# Altium schematic sheet MT-MONITOR V1.0.0.SchDoc
size A1; SheetNumber: 0; SheetTotal: 0
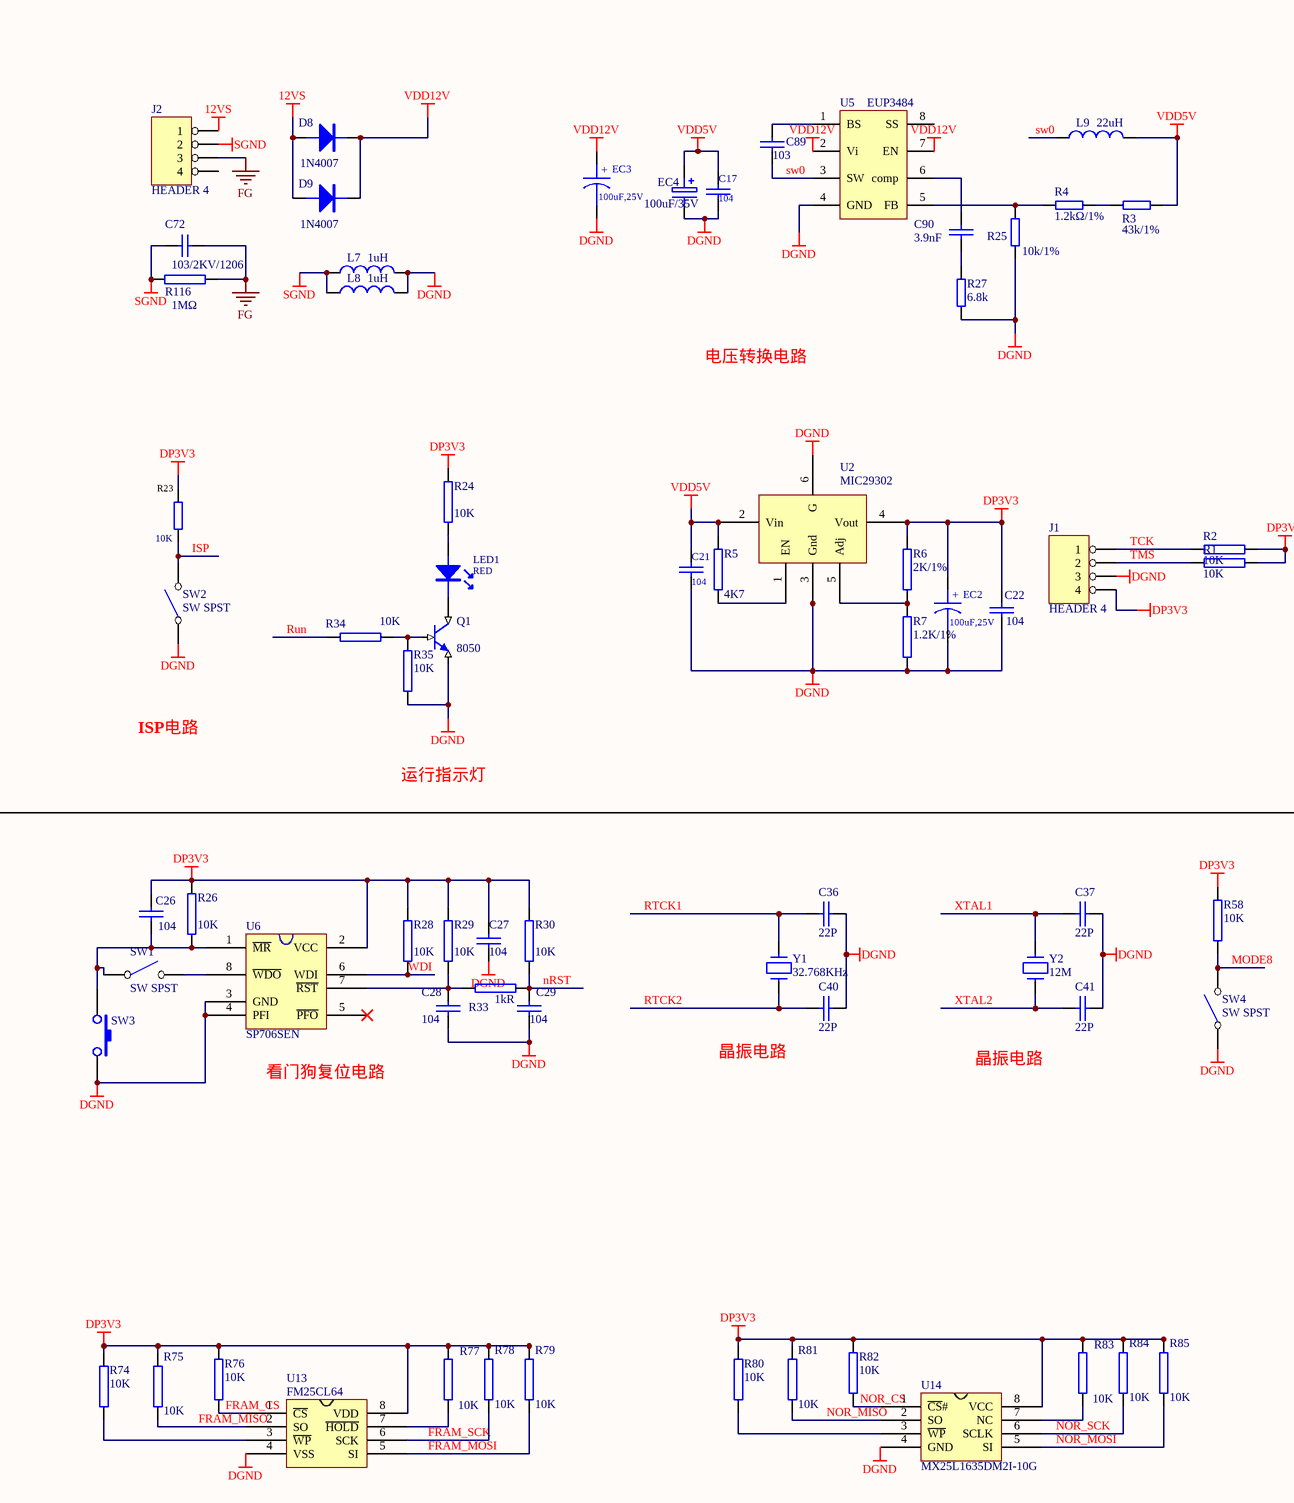
[diagram p0: MT-MONITOR V1.0.0.SchDoc, top left]
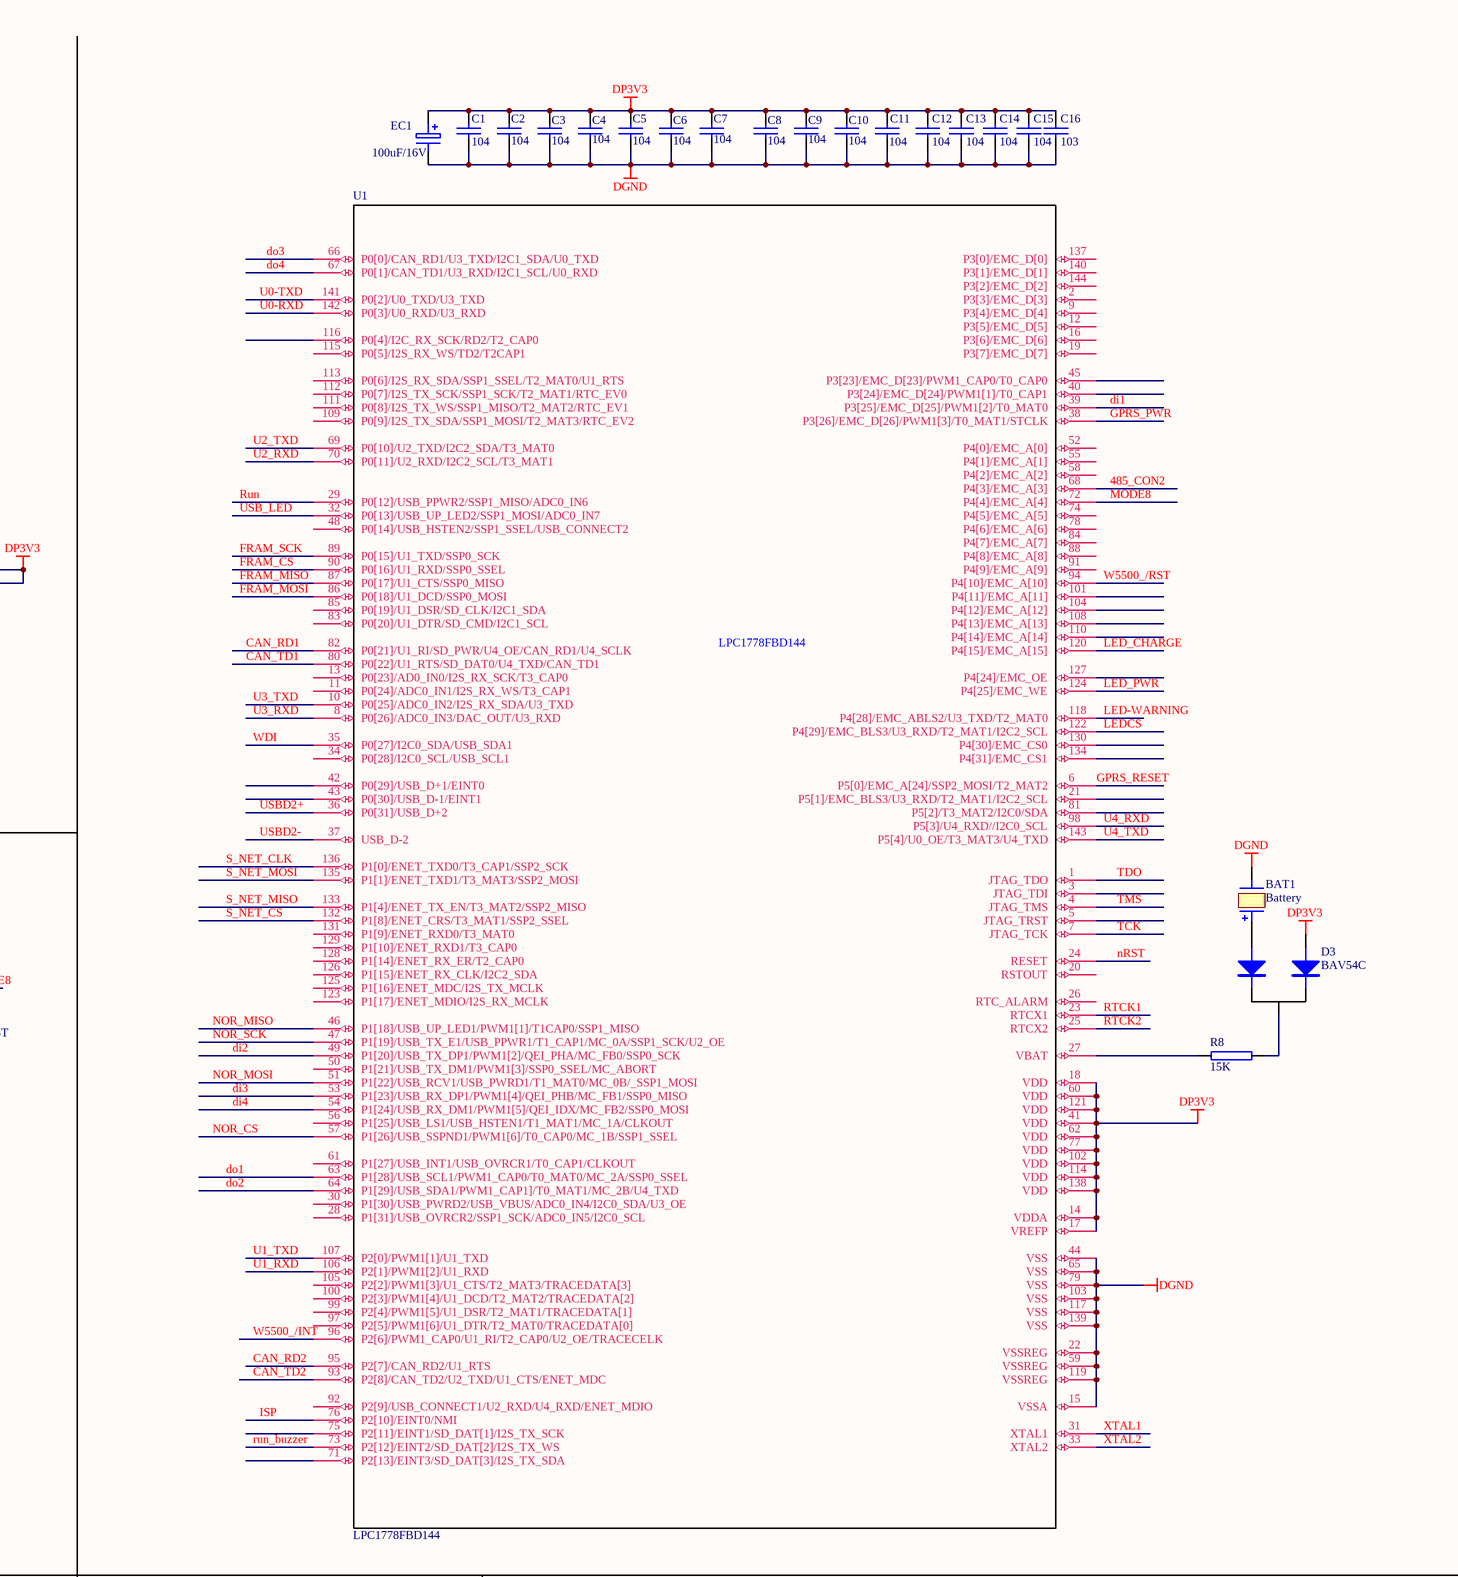
[diagram p1: MT-MONITOR V1.0.0.SchDoc, top middle]
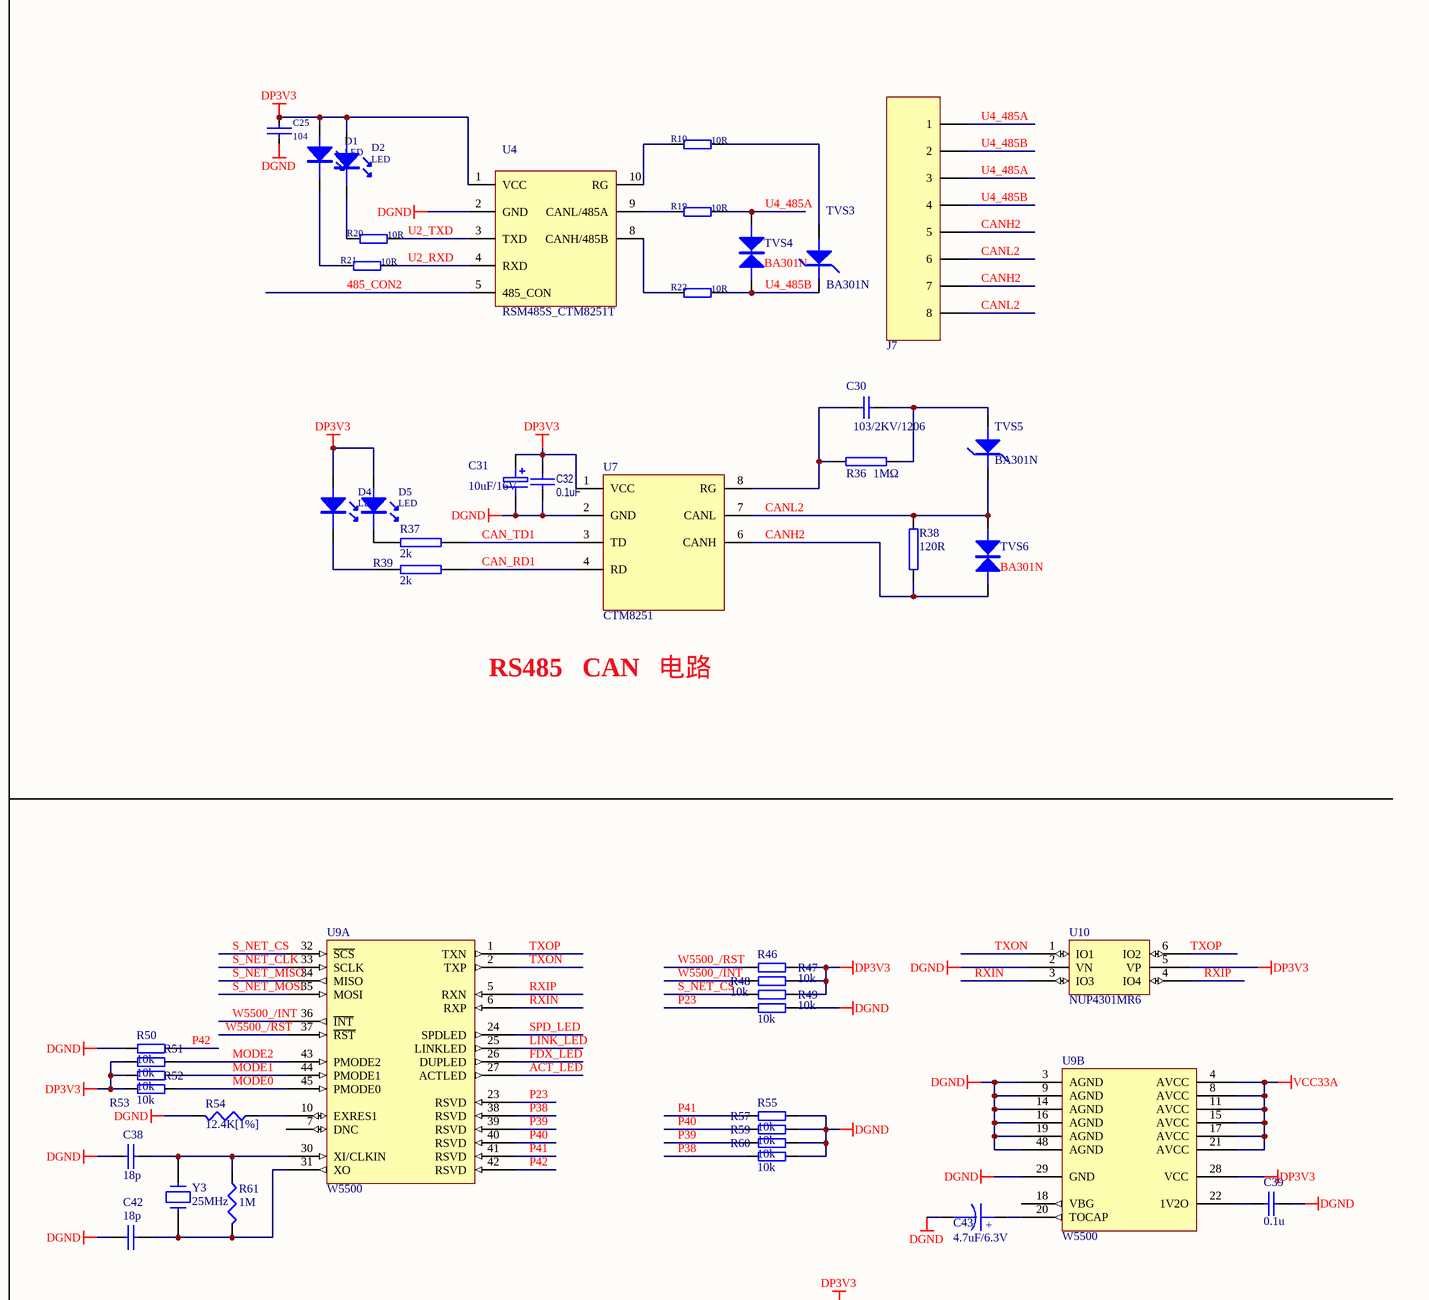
[diagram p2: MT-MONITOR V1.0.0.SchDoc, top right]
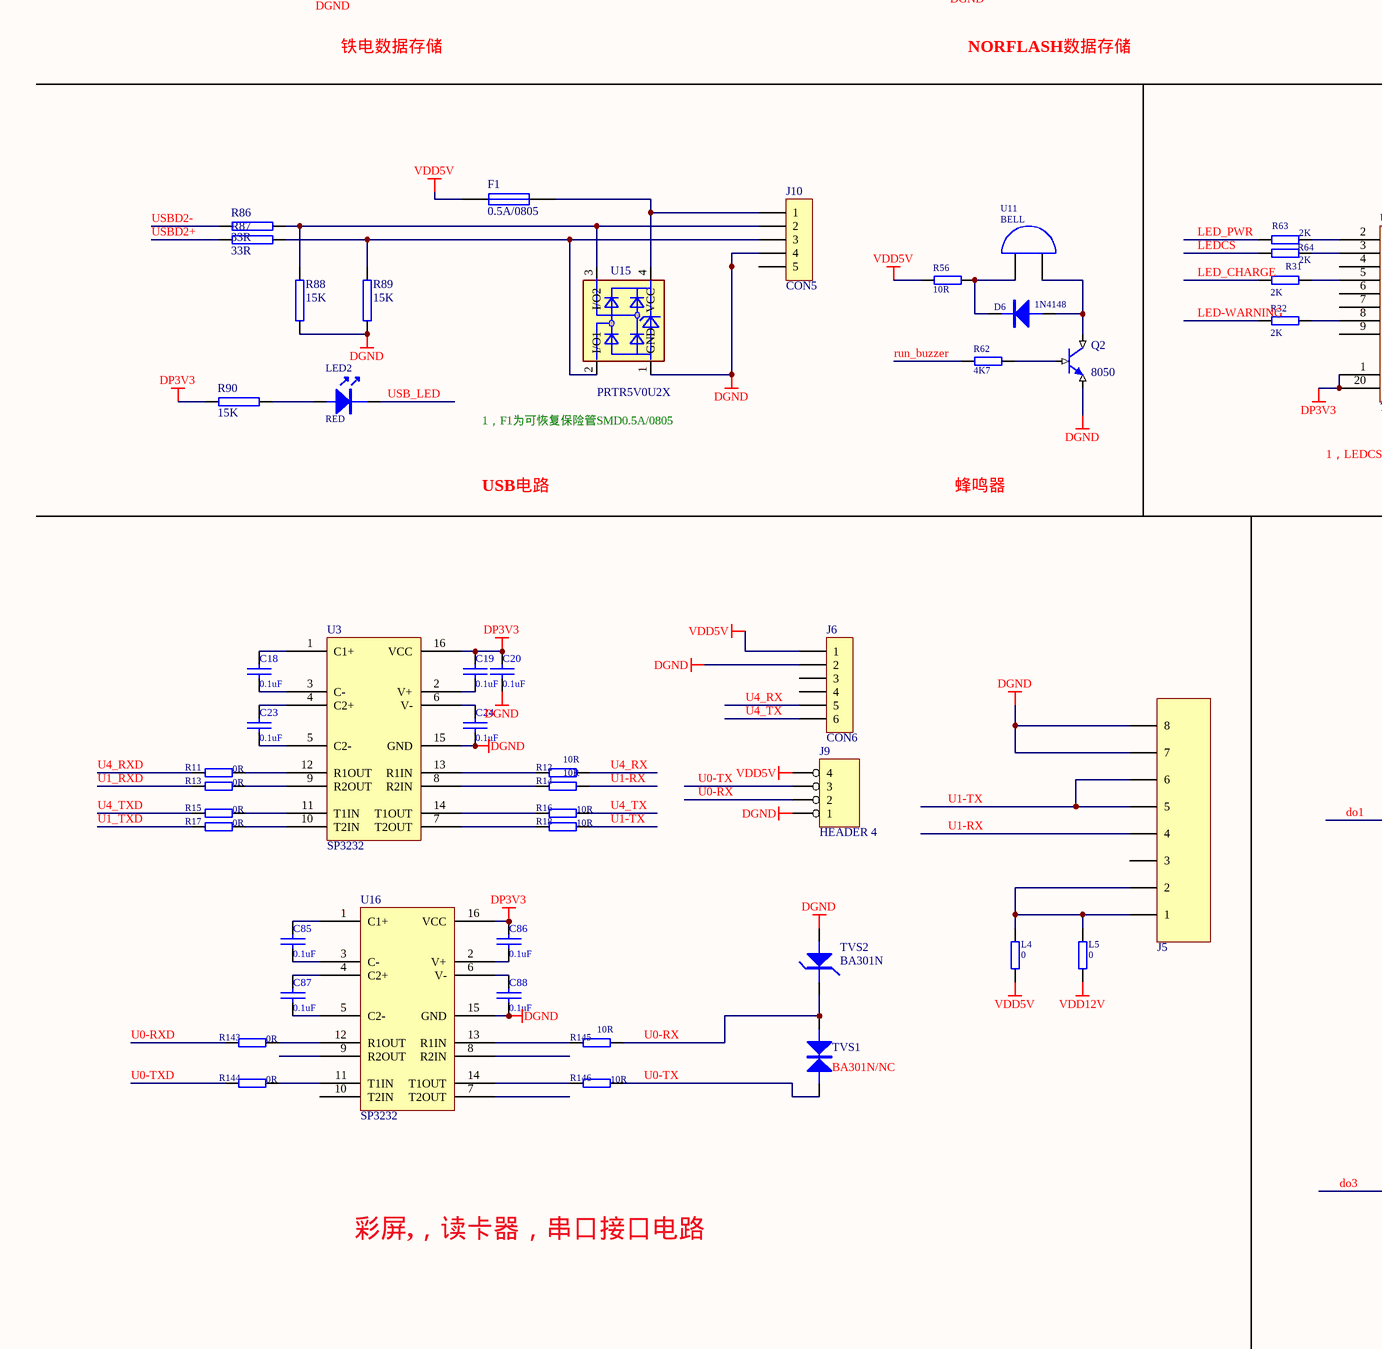
[diagram p3: MT-MONITOR V1.0.0.SchDoc, bottom left]
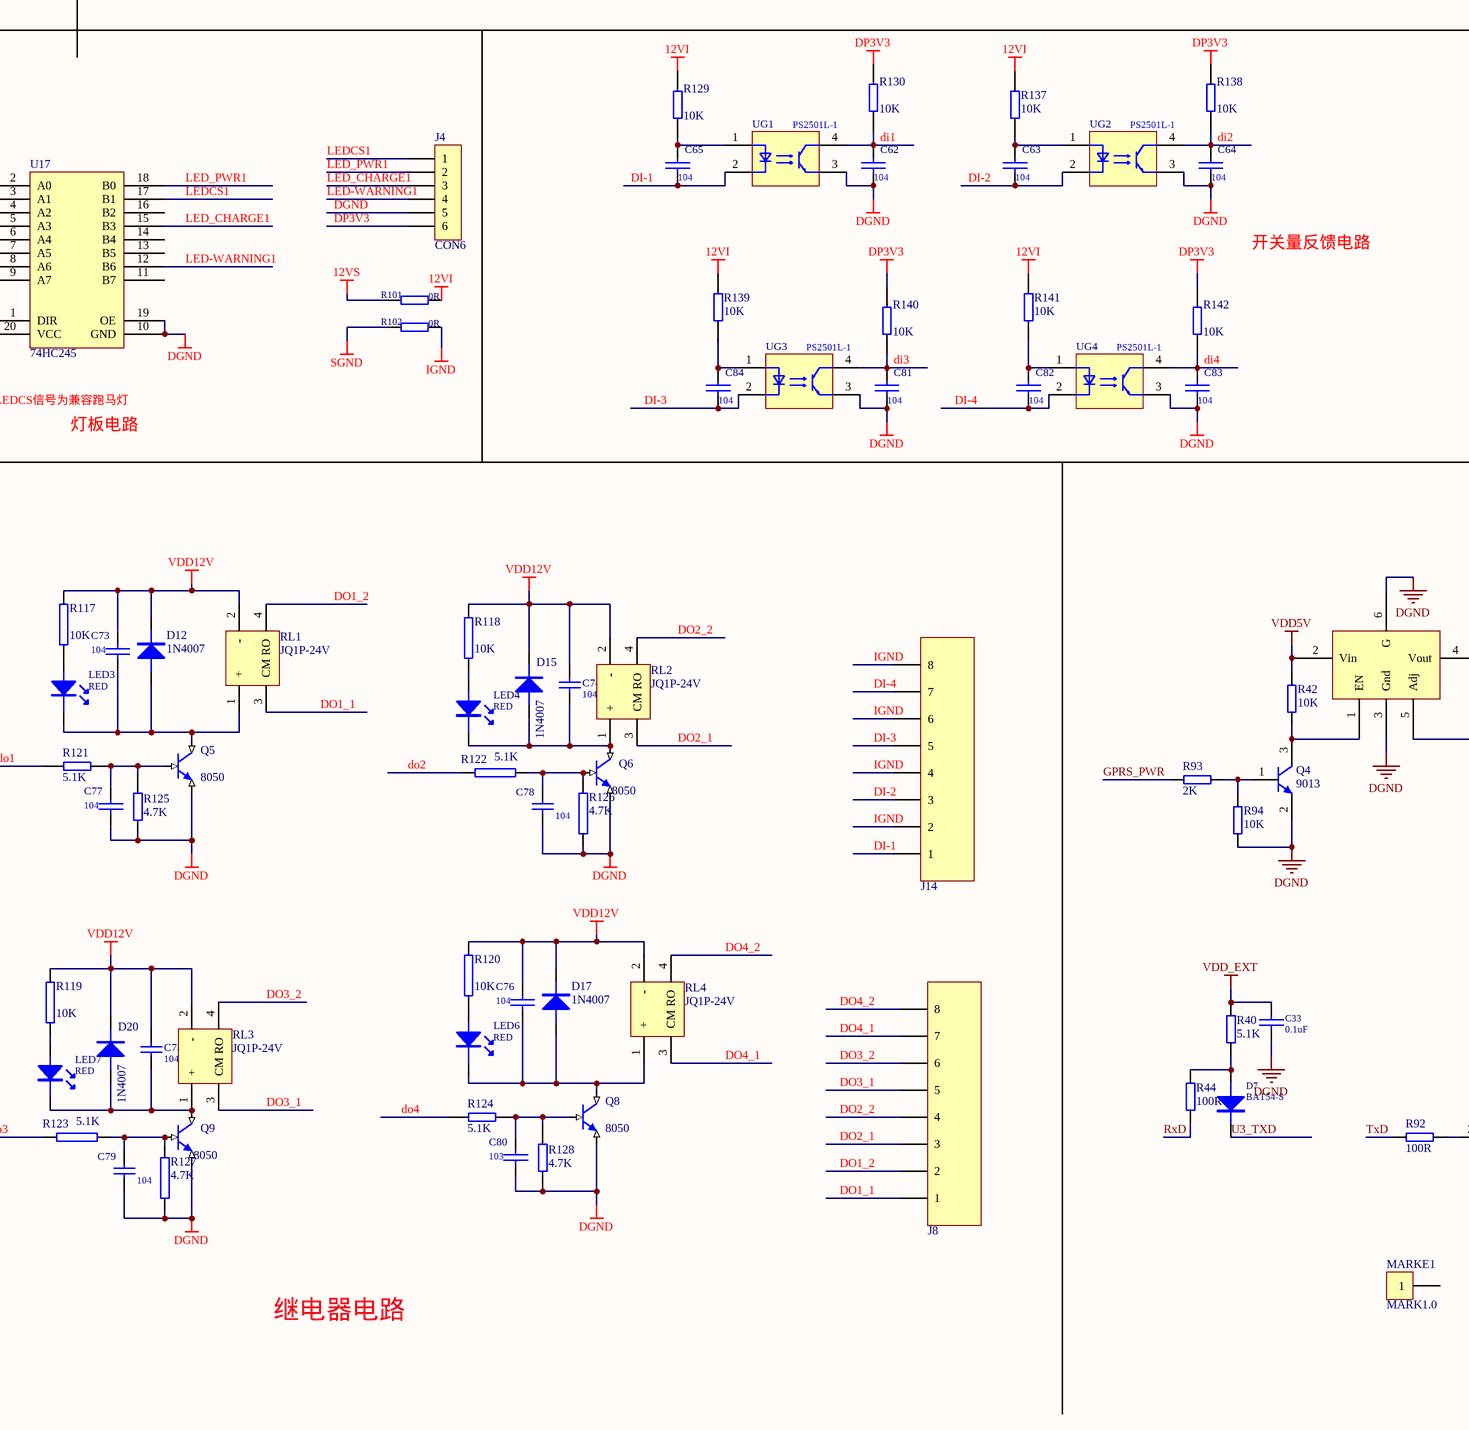
[diagram p4: MT-MONITOR V1.0.0.SchDoc, bottom middle]
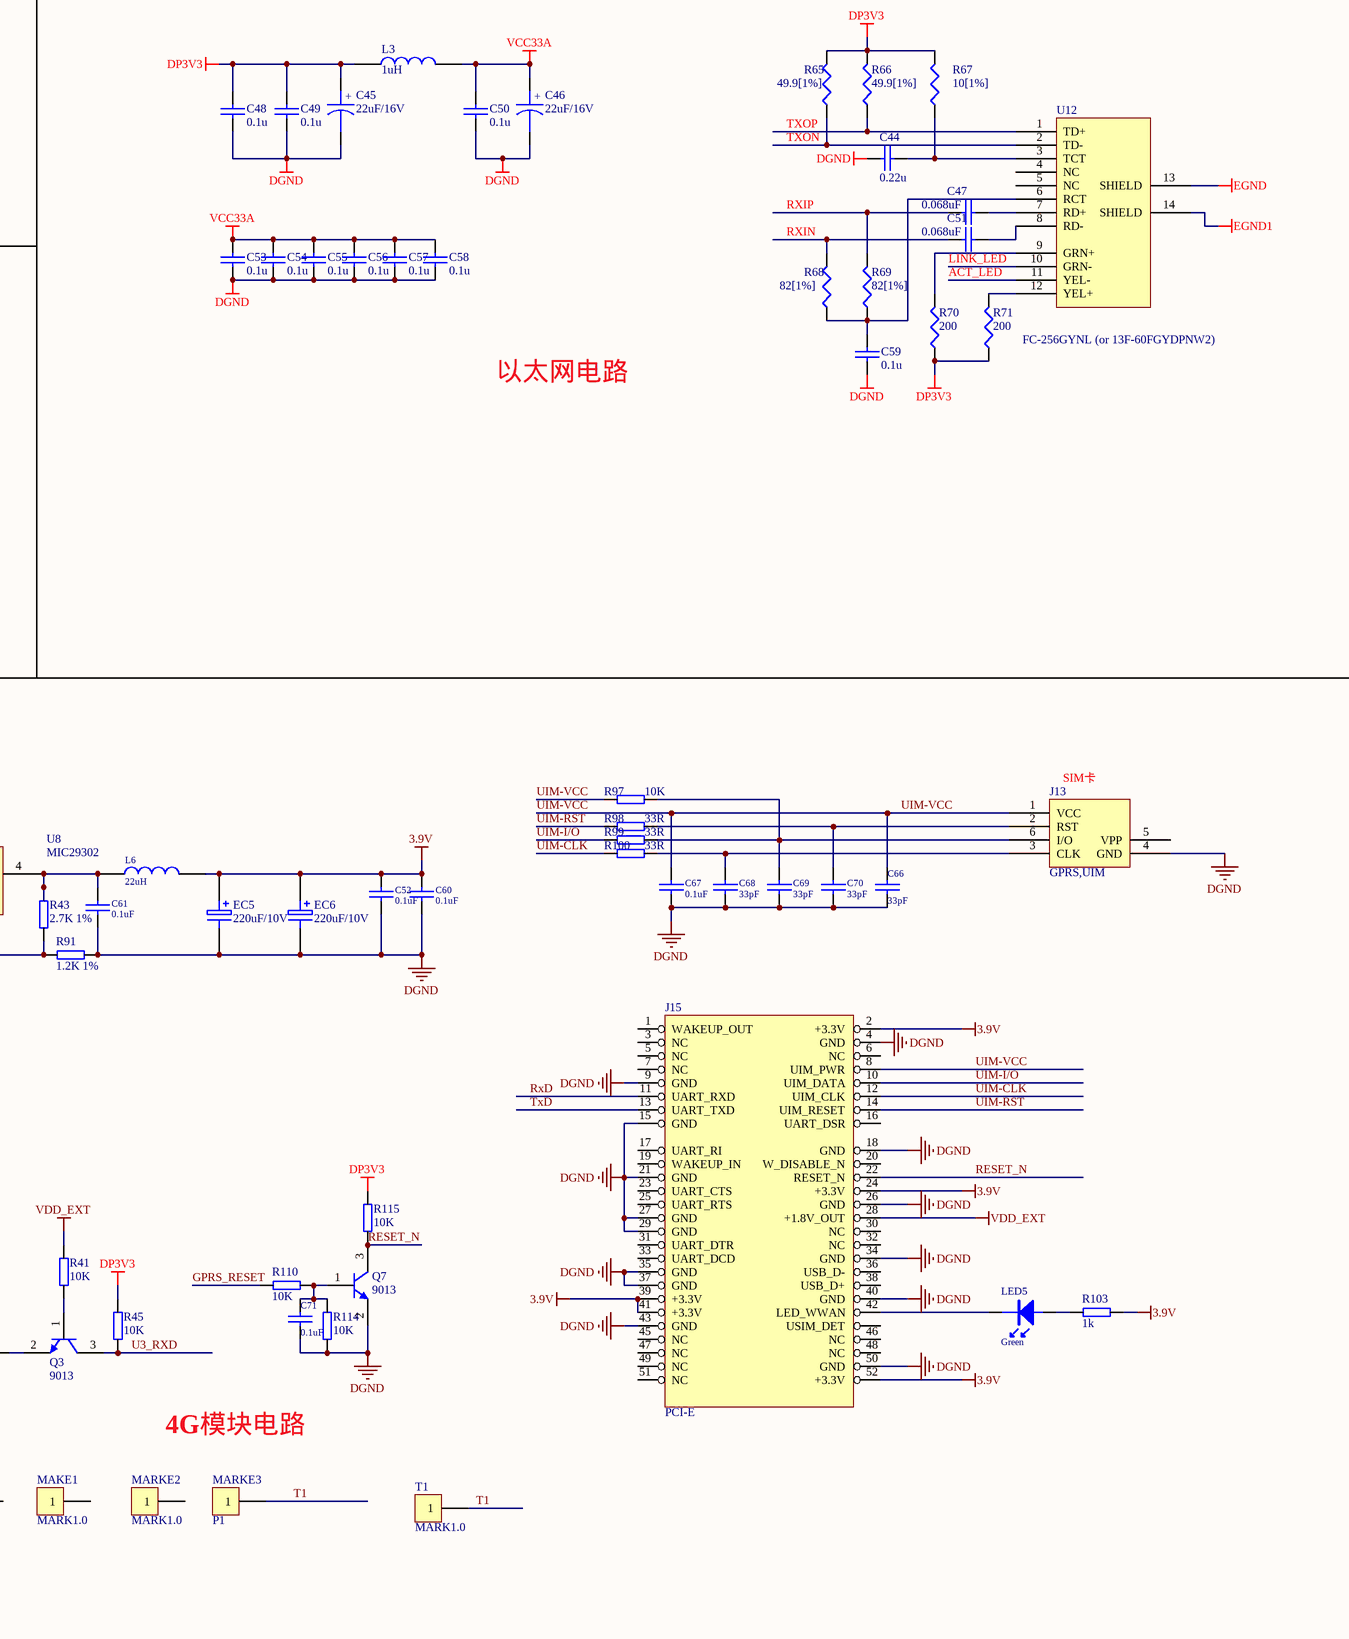
[diagram p5: MT-MONITOR V1.0.0.SchDoc, bottom right]

## Parts
BAT1  Battery  [battery]
C1  104  [0603C]
C2  104  [0603C]
C3  104  [0603C]
C4  104  [0603C]
C5  104  [0603C]
C6  104  [0603C]
C7  104  [0603C]
C8  104  [0603C]
C9  104  [0603C]
C10  104  [0603C]
C11  104  [0603C]
C12  104  [0603C]
C13  104  [0603C]
C14  104  [0603C]
C15  104  [0603C]
C16  103  [0603C]
C17  104  [0603C]
C18  0.1uF  [0603C]
C19  0.1uF  [0603C]
C20  0.1uF  [0603C]
C21  104  [0603C]
C22  104  [0603C]
C23  0.1uF  [0603C]
C24  0.1uF  [0603C]
C25  104  [0603C]
C26  104  [0603C]
C27  104  [0603C]
C28  104  [0603C]
C29  104  [0603C]
C30  103/2KV/1206  [1206C]
C31  10uF/16V  [CA1206]
C32  0.1uF  [0603C]
C33  0.1uF  [C0603]
C36  22P  [0603C]
C37  22P  [0603C]
C38  18p  [0603C]
C39  0.1u  [0603C]
C40  22P  [0603C]
C41  22P  [0603C]
C42  18p  [0603C]
C43  4.7uF/6.3V  [CA1206]
C44  0.22u  [0603C]
C45  22uF/16V  [CA1206]
C46  22uF/16V  [CA1206]
C47  0.068uF  [0603C]
C48  0.1u  [0603C]
C49  0.1u  [0603C]
C50  0.1u  [0603C]
C51  0.068uF  [0603C]
C52  0.1uF  [C0603]
C53  0.1u  [0603C]
C54  0.1u  [0603C]
C55  0.1u  [0603C]
C56  0.1u  [0603C]
C57  0.1u  [0603C]
C58  0.1u  [0603C]
C59  0.1u  [0603C]
C60  0.1uF  [C0603]
C61  0.1uF  [C0603]
C62  104  [0603C]
C63  104  [0603C]
C64  104  [0603C]
C65  104  [0603C]
C66  33pF  [C0603]
C67  0.1uF  [C0603]
C68  33pF  [C0603]
C69  33pF  [C0603]
C70  33pF  [C0603]
C71  0.1uF  [C0603]
C72  103/2KV/1206  [1206C]
C73  104  [0603C]
C74  104  [0603C]
C75  104  [0603C]
C76  104  [0603C]
C77  104  [0603C]
C78  104  [0603C]
C79  104  [0603C]
C80  103  [0603C]
C81  104  [0603C]
C82  104  [0603C]
C83  104  [0603C]
C84  104  [0603C]
C85  0.1uF  [0603C]
C86  0.1uF  [0603C]
C87  0.1uF  [0603C]
C88  0.1uF  [0603C]
C89  103  [0603C]
C90  3.9nF  [0603C]
D1  LED  [D0805]
D2  LED  [D0805]
D3  BAV54C  [SOT23]
D4  LED  [D0805]
D5  LED  [D0805]
D6  1N4148  [1206D]
D7  BAT54-S  [SOT23]
D8  1N4007  [1206D]
D9  1N4007  [1206D]
D12  1N4007  [1206D]
D15  1N4007  [1206D]
D17  1N4007  [1206D]
D20  1N4007  [1206D]
EC1  100uF/16V  [C100UF16VEJ]
EC2  100uF,25V  [C100UF16VEJ]
EC3  100uF,25V  [C100UF16VEJ]
EC4  100uF/35V  [C100UF16VEJ]
EC5  220uF/10V  [C100UF16V]
EC6  220uF/10V  [C100UF16V]
F1  0.5A/0805  [0805R]
J1  HEADER 4  [COM-2.54mm-90]
J2  HEADER 4  [KF2EDG-4P-3.81mm]
J4  CON6  [CON6-2.54mm-90]
J5  CON8  [HY-8A-2.00mm]  (value not drawn)
J6  CON6  [CON6-2.54mm-90]
J7  CON8  [KF2EDG-8P-3.81mm]  (value not drawn)
J8  CON8  [KF2EDG-8P-3.81mm]  (value not drawn)
J9  HEADER 4  [KF2EDG-4P-3.81mm]
J10  CON5  [USB-A]
J13  GPRS,UIM  [SIM6-AUTO]
J14  CON8  [KF2EDG-8P-3.81mm]  (value not drawn)
J15  PCI-E  [MC2716]
L3  1uH  [0805R]
L4  0  [CON02_2.54]
L5  0  [CON02_2.54]
L6  22uH  [LC7*7*3_L]
L7  1uH  [1206R]
L8  1uH  [1206R]
L9  22uH  [LC7*7*3_L]
LED1  RED  [D0805]
LED2  RED  [D0805]
LED3  RED  [D0805]
LED4  RED  [D0805]
LED5  Green  [D0805]
LED6  RED  [D0805]
LED7  RED  [D0805]
MAKE1  MARK1.0  [MARK1.0]
MARKE1  MARK1.0  [MARK1.0]
MARKE2  MARK1.0  [MARK1.0]
MARKE3  P1  [IPEX]
Q1  8050  [SOT23]
Q2  8050  [SOT23]
Q3  9013  [SOT23]
Q4  9013  [SOT23]
Q5  8050  [SOT23]
Q6  8050  [SOT23]
Q7  9013  [SOT23]
Q8  8050  [SOT23]
Q9  8050  [SOT23]
R1  10K  [0603R]
R2  10K  [0603R]
R3  43k/1%  [0603R]
R4  1.2kΩ/1%  [0603R]
R5  4K7  [0603R]
R6  2K/1%  [0603R]
R7  1.2K/1%  [0603R]
R8  15K  [0603R]
R10  10R  [0603R]
R11  0R  [0603R]
R12  10R  [0603R]
R13  0R  [0603R]
R14  10R  [0603R]
R15  0R  [0603R]
R16  10R  [0603R]
R17  0R  [0603R]
R18  10R  [0603R]
R19  10R  [0603R]
R20  10R  [0603R]
R21  10R  [0603R]
R22  10R  [0603R]
R23  10K  [0603R]
R24  10K  [0603R]
R25  10k/1%  [0603R]
R26  10K  [0603R]
R27  6.8k  [0603R]
R28  10K  [0603R]
R29  10K  [0603R]
R30  10K  [0603R]
R31  2K  [0603R]
R32  2K  [0603R]
R33  1kR  [0603R]
R34  10K  [0603R]
R35  10K  [0603R]
R36  value 1MΩ  [1206R]  (hidden comment: 1M)
R37  2k  [0603R]
R38  120R  [1206R]
R39  2k  [0603R]
R40  5.1K  [R0603]
R41  10K  [R0603]
R42  10K  [R0603]
R43  2.7K 1%  [R0603]
R44  100R  [R0603]
R45  10K  [R0603]
R46  10k  [0603R]
R47  10k  [0603R]
R48  10k  [0603R]
R49  10k  [0603R]
R50  10k  [0603R]
R51  10k  [0603R]
R52  10k  [0603R]
R53  10k  [0603R]
R54  12.4K[1%]  [0603R]
R55  10k  [0603R]
R56  10R  [0603R]
R57  10k  [0603R]
R58  10K  [0603R]
R59  10k  [0603R]
R60  10k  [0603R]
R61  1M  [0603R]
R62  4K7  [0603R]
R63  2K  [0603R]
R64  2K  [0603R]
R65  49.9[1%]  [0603R]
R66  49.9[1%]  [0603R]
R67  10[1%]  [0603R]
R68  82[1%]  [0603R]
R69  82[1%]  [0603R]
R70  200  [0603R]
R71  200  [0603R]
R74  10K  [0603R]
R75  10K  [0603R]
R76  10K  [0603R]
R77  10K  [0603R]
R78  10K  [0603R]
R79  10K  [0603R]
R80  10K  [0603R]
R81  10K  [0603R]
R82  10K  [0603R]
R83  10K  [0603R]
R84  10K  [0603R]
R85  10K  [0603R]
R86  33R  [0603R]
R87  33R  [0603R]
R88  15K  [0603R]
R89  15K  [0603R]
R90  15K  [0603R]
R91  1.2K 1%  [R0603]
R92  100R  [R0603]
R93  2K  [R0603]
R94  10K  [R0603]
R97  10K  [R0603]
R98  33R  [R0603]
R99  33R  [R0603]
R100  33R  [R0603]
R101  0R  [0603R]
R102  0R  [0603R]
R103  1k  [R0603]
R110  10K  [R0603]
R114  10K  [R0603]
R115  10K  [R0603]
R116  value 1MΩ  [1206R]  (hidden comment: 1M)
R117  10K  [0603R]
R118  10K  [0603R]
R119  10K  [0603R]
R120  10K  [0603R]
R121  5.1K  [0603R]
R122  5.1K  [0603R]
R123  5.1K  [0603R]
R124  5.1K  [0603R]
R125  4.7K  [0603R]
R126  4.7K  [0603R]
R127  4.7K  [0603R]
R128  4.7K  [0603R]
R129  10K  [0603R]
R130  10K  [0603R]
R137  10K  [0603R]
R138  10K  [0603R]
R139  10K  [0603R]
R140  10K  [0603R]
R141  10K  [0603R]
R142  10K  [0603R]
R143  0R  [0603R]
R144  0R  [0603R]
R145  10R  [0603R]
R146  10R  [0603R]
RL1  JQ1P-24V  [HF32F-12V]
RL2  JQ1P-24V  [HF32F-12V]
RL3  JQ1P-24V  [HF32F-12V]
RL4  JQ1P-24V  [HF32F-12V]
SW1  SW SPST  [SW1]
SW2  SW SPST  [SW1]
SW3  按键  [SW]  (value not drawn)
SW4  SW SPST  [SW1]
T1  MARK1.0  [TXZ-GSM]
TVS1  BA301N/NC  [3528TVS]
TVS2  BA301N  [3528TVS]
TVS3  BA301N  [3528TVS]
TVS4  BA301N  [3528TVS]
TVS5  BA301N  [3528TVS]
TVS6  BA301N  [3528TVS]
U1  LPC1778FBD144  [LC-LQFP-144_20x20x05P]
U2  MIC29302  [TO5B]
U3  SP3232  [SO-16]
U4  RSM485S_CTM8251T  [RSM485]
U5  EUP3484  [SOP8]
U6  SP706SEN  [SOP8]
U7  CTM8251  [CTM8251KT]
U8  MIC29302  [TO5B]
U9  W5500  [W5500]  (parts A,B of 2)
U10  NUP4301MR6  [TSOP-6]
U11  BELL  [BUZ]
U12  FC-256GYNL (or 13F-60FGYDPNW2)  [RJ45-2]
U13  FM25CL64  [SOP8]
U14  MX25L1635DM2I-10G  [MX25L1635E]
U15  PRTR5V0U2X  [SOT-143B]
U16  SP3232  [SO-16]
U17  74HC245  [TSSOP20]
UG1  PS2501L-1  [DIP-4]
UG2  PS2501L-1  [DIP-4]
UG3  PS2501L-1  [DIP-4]
UG4  PS2501L-1  [DIP-4]
Y1  32.768KHz  [ZS-32.768]
Y2  12M  [ZS_SMD]
Y3  25MHz  [ZS_SMD]

## Nets
3.9V: C52.1 C60.1 EC5.1 EC6.1 J15.2(+3.3V) J15.24(+3.3V) J15.39(+3.3V) J15.41(+3.3V) J15.52(+3.3V) L6.2 R103.1
12VI: R101.2 R129.1 R137.1 R139.1 R141.1
12VS: D8.1(A) D9.1(A) J2.1 R101.1
DGND: BAT1.2 C1.2 C2.2 C3.2 C4.2 C5.2 C6.2 C7.2 C8.2 C9.2 C10.2 C11.2 C12.1 C13.2 C14.2 C15.2 C16.2 C17.1 C20.1 C21.1 C22.2 C24.1 C25.2 C27.2 C28.1 C29.1 C31.2 C32.1 C33.2 C36.2 C37.2 C38.2 C39.1 C40.2 C41.2 C42.2 C43.2 C44.1 C45.2 C46.2 C48.2 C49.2 C50.2 C52.2 C53.2 C54.2 C55.2 C56.2 C57.2 C58.2 C59.2 C60.2 C61.2 C62.2 C64.2 C66.2 C67.2 C68.2 C69.2 C70.2 C71.2 C77.2 C78.1 C79.1 C80.2 C81.2 C83.2 C88.1 EC1.2 EC2.2 EC3.2 EC4.2 EC5.2 EC6.2 J1.3 J4.5 J5.7 J5.8 J6.2 J9.1 J10.4 J13.4(GND) J15.4(GND) J15.9(GND) J15.15(GND) J15.18(GND) J15.21(GND) J15.26(GND) J15.27(GND) J15.29(GND) J15.34(GND) J15.35(GND) J15.37(GND) J15.40(GND) J15.43(GND) J15.50(GND) L7.2 L8.2 Q1.3(E) Q2.3(E) Q4.2(E) Q5.3(E) Q6.3(E) Q7.2(E) Q8.3(E) Q9.3(E) R7.1 R25.2 R27.2 R35.1 R49.2 R50.1 R54.2 R55.2 R57.2 R59.2 R60.2 R88.1 R89.1 R91.2 R94.1 R114.2 R125.1 R126.1 R127.1 R128.1 SW2.1(COMMON) SW3.2 SW4.1(COMMON) TVS2.1 U1.15(VSSA) U1.22(VSSREG) U1.44(VSS) U1.59(VSSREG) U1.65(VSS) U1.79(VSS) U1.103(VSS) U1.117(VSS) U1.119(VSSREG) U1.139(VSS) U2.3(Gnd) U2.6(G) U3.15(GND) U4.2(GND) U5.4(GND) U6.3(GND) U6.4(PFI) U7.2(GND) U8.3(Gnd) U8.6(G) U9.3(AGND) U9.9(AGND) U9.14(AGND) U9.16(AGND) U9.19(AGND) U9.29(GND) U9.48(AGND) U10.2(VN) U13.4(VSS) U14.4(GND) U15.1(GND) U16.15(GND) U17.10(GND) U17.19(OE) UG1.3 UG2.3 UG3.3 UG4.3
DP3V3: C1.1 C2.1 C3.1 C4.1 C5.1 C6.1 C7.1 C8.1 C9.1 C10.1 C11.1 C12.2 C13.1 C14.1 C15.1 C16.1 C19.2 C20.2 C22.1 C25.1 C26.1 C27.1 C31.1 C32.2 C45.1 C48.1 C49.1 C86.2 D1.1 D2.1 D3.1(A) D4.1 D5.1 EC1.1 EC2.1 J1.4 J4.6 L3.1 R1.2 R2.2 R6.2 R23.2 R24.2 R26.2 R28.1 R29.1 R30.1 R45.1 R46.2 R47.2 R48.2 R51.1 R52.1 R53.1 R58.2 R65.2 R66.2 R67.2 R70.1 R71.1 R74.1 R75.1 R76.1 R77.1 R78.1 R79.1 R80.1 R81.1 R82.1 R83.1 R84.1 R85.1 R90.2 R115.1 R130.1 R138.1 R140.1 R142.1 U1.14(VDDA) U1.17(VREFP) U1.18(VDD) U1.41(VDD) U1.60(VDD) U1.62(VDD) U1.77(VDD) U1.102(VDD) U1.114(VDD) U1.121(VDD) U1.138(VDD) U2.4(Vout) U3.16(VCC) U4.1(VCC) U6.2(VCC) U7.1(VCC) U9.28(VCC) U10.5(VP) U13.8(VDD) U14.8(VCC) U16.16(VCC) U17.1(DIR) U17.20(VCC)
EGND: U12.13(SHIELD)
EGND1: U12.14(SHIELD)
FG: C72.2 J2.3 R116.2
IGND: J14.2 J14.4 J14.6 J14.8 R102.2
SGND: C72.1 J2.2 L7.1 L8.1 R102.1 R116.1
VCC33A: C46.1 C50.1 C53.1 C54.1 C55.1 C56.1 C57.1 C58.1 L3.2 U9.4(AVCC) U9.8(AVCC) U9.11(AVCC) U9.15(AVCC) U9.17(AVCC) U9.21(AVCC)
VDD5V: C17.2 C21.2 EC4.1 F1.1 J6.1 J9.4 L4.1 L9.2 R3.1 R5.1 R42.2 R56.2 U2.2(Vin) U8.2(Vin)
VDD12V: C73.1 C74.2 C75.2 C76.1 D8.2(K) D9.2(K) D12.2(K) D15.2(K) D17.2(K) D20.2(K) EC3.1 L5.2 R117.2 R118.2 R119.2 R120.2 RL1.2(-) RL2.2(-) RL3.2(-) RL4.2(-) U5.2(Vi) U5.7(EN)
VDD_EXT: C33.1 J15.28(+1.8V_OUT) R40.2 R41.2
485_CON2: U1.68(P4[3]/EMC_A[3]) U4.5(485_CON)
ACT_LED: U9.27(ACTLED) U12.11(YEL-)
CAN_RD1: R39.2 U1.82(P0[21]/U1_RI/SD_PWR/U4_OE/CAN_RD1/U4_SCLK) U7.4(RD)
CAN_RD2: U1.95(P2[7]/CAN_RD2/U1_RTS)
CAN_TD1: R37.2 U1.80(P0[22]/U1_RTS/SD_DAT0/U4_TXD/CAN_TD1) U7.3(TD)
CAN_TD2: U1.93(P2[8]/CAN_TD2/U2_TXD/U1_CTS/ENET_MDC)
CANH2: J7.5 J7.7 R38.2 TVS6.1 U7.6(CANH)
CANL2: J7.6 J7.8 R38.1 TVS5.2 TVS6.2 U7.7(CANL)
di1: C62.1 R130.2 U1.39(P3[25]/EMC_D[25]/PWM1[2]/T0_MAT0) UG1.4
di2: C64.1 R138.2 U1.49(P1[20]/USB_TX_DP1/PWM1[2]/QEI_PHA/MC_FB0/SSP0_SCK) UG2.4
di3: C81.1 R140.2 U1.53(P1[23]/USB_RX_DP1/PWM1[4]/QEI_PHB/MC_FB1/SSP0_MISO) UG3.4
di4: C83.1 R142.2 U1.54(P1[24]/USB_RX_DM1/PWM1[5]/QEI_IDX/MC_FB2/SSP0_MOSI) UG4.4
DI-1: C65.2 J14.1 UG1.2
DI-2: C63.2 J14.3 UG2.2
DI-3: C84.2 J14.5 UG3.2
DI-4: C82.2 J14.7 UG4.2
do1: R121.1 U1.63(P1[28]/USB_SCL1/PWM1_CAP0/T0_MAT0/MC_2A/SSP0_SSEL)
DO1_1: J8.1 RL1.3(CM)
DO1_2: J8.2 RL1.4(RO)
do2: R122.1 U1.64(P1[29]/USB_SDA1/PWM1_CAP1]/T0_MAT1/MC_2B/U4_TXD)
DO2_1: J8.3 RL2.3(CM)
DO2_2: J8.4 RL2.4(RO)
do3: R123.1 U1.66(P0[0]/CAN_RD1/U3_TXD/I2C1_SDA/U0_TXD)
DO3_1: J8.5 RL3.3(CM)
DO3_2: J8.6 RL3.4(RO)
do4: R124.1 U1.67(P0[1]/CAN_TD1/U3_RXD/I2C1_SCL/U0_RXD)
DO4_1: J8.7 RL4.3(CM)
DO4_2: J8.8 RL4.4(RO)
FDX_LED: U9.26(DUPLED)
FRAM_CS: R76.2 U1.90(P0[16]/U1_RXD/SSP0_SSEL) U13.1(~{CS})
FRAM_MISO: R75.2 U1.87(P0[17]/U1_CTS/SSP0_MISO) U13.2(SO)
FRAM_MOSI: R79.2 U1.86(P0[18]/U1_DCD/SSP0_MOSI) U13.5(SI)
FRAM_SCK: R78.2 U1.89(P0[15]/U1_TXD/SSP0_SCK) U13.6(SCK)
GPRS_PWR: R93.1 U1.38(P3[26]/EMC_D[26]/PWM1[3]/T0_MAT1/STCLK)
GPRS_RESET: R110.2 U1.6(P5[0]/EMC_A[24]/SSP2_MOSI/T2_MAT2)
ISP: R23.1 SW2.2(NO) U1.76(P2[10]/EINT0/NMI)
LED-WARNING: R32.1 U1.118(P4[28]/EMC_ABLS2/U3_TXD/T2_MAT0)
LED-WARNING1: J4.4 U17.12(B6)
LED_CHARGE: R31.1 U1.120(P4[15]/EMC_A[15])
LED_CHARGE1: J4.3 U17.15(B3)
LED_PWR: R63.1 U1.124(P4[25]/EMC_WE)
LED_PWR1: J4.2 U17.18(B0)
LEDCS: R64.1 U1.122(P4[29]/EMC_BLS3/U3_RXD/T2_MAT1/I2C2_SCL)
LEDCS1: J4.1 U17.17(B1)
LINK_LED: U9.25(LINKLED) U12.10(GRN-)
MODE0: R53.2 U9.45(PMODE0)
MODE1: R52.2 U9.44(PMODE1)
MODE2: R51.2 U9.43(PMODE2)
MODE8: R58.1 SW4.2(NO) U1.72(P4[4]/EMC_A[4])
NOR_CS: R82.2 U1.57(P1[26]/USB_SSPND1/PWM1[6]/T0_CAP0/MC_1B/SSP1_SSEL) U14.1(~{CS}#)
NOR_MISO: R81.2 U1.46(P1[18]/USB_UP_LED1/PWM1[1]/T1CAP0/SSP1_MISO) U14.2(SO)
NOR_MOSI: R85.2 U1.51(P1[22]/USB_RCV1/USB_PWRD1/T1_MAT0/MC_0B/_SSP1_MOSI) U14.5(SI)
NOR_SCK: R84.2 U1.47(P1[19]/USB_TX_E1/USB_PPWR1/T1_CAP1/MC_0A/SSP1_SCK/U2_OE) U14.6(SCLK)
nRST: C29.2 R30.2 R33.2 U1.24(RESET)
P23: R49.1 U9.23(RSVD)
P38: R60.1 U9.38(RSVD)
P39: R59.1 U9.39(RSVD)
P40: R57.1 U9.40(RSVD)
P41: R55.1 U9.41(RSVD)
P42: R50.2 U9.42(RSVD)
RESET_N: J15.22(RESET_N) Q7.3(C) R115.2
RTCK1: C36.1 U1.23(RTCX1) Y1.1
RTCK2: C40.1 U1.25(RTCX2) Y1.2
Run: R34.1 U1.29(P0[12]/USB_PPWR2/SSP1_MISO/ADC0_IN6)
run_buzzer: R62.2 U1.73(P2[12]/EINT2/SD_DAT[2]/I2S_TX_WS)
RxD: J15.11(UART_RXD) R44.1
RXIN: C51.1 R68.2 U9.6(RXP) U10.3(IO3)
RXIP: C47.1 R69.2 U9.5(RXN) U10.4(IO4)
S_NET_CLK: U1.136(P1[0]/ENET_TXD0/T3_CAP1/SSP2_SCK) U9.33(SCLK)
S_NET_CS: R48.1 U1.132(P1[8]/ENET_CRS/T3_MAT1/SSP2_SSEL) U9.32(~{SCS})
S_NET_MISO: U1.133(P1[4]/ENET_TX_EN/T3_MAT2/SSP2_MISO) U9.34(MISO)
S_NET_MOSI: U1.135(P1[1]/ENET_TXD1/T3_MAT3/SSP2_MOSI) U9.35(MOSI)
SPD_LED: U9.24(SPDLED)
sw0: C89.1 L9.1 U5.3(SW)
T1: MARKE3.1 T1.1
TCK: J1.1 R2.1 U1.7(JTAG_TCK)
TDO: U1.1(JTAG_TDO)
TMS: J1.2 R1.1 U1.4(JTAG_TMS)
TxD: J15.13(UART_TXD) R92.2
TXON: R65.1 U9.2(TXP) U10.1(IO1) U12.2(TD-)
TXOP: R66.1 U9.1(TXN) U10.6(IO2) U12.1(TD+)
U0-RX: J9.2 R145.2 TVS1.2 TVS2.2
U0-RXD: R143.1 U1.142(P0[3]/U0_RXD/U3_RXD)
U0-TX: J9.3 R146.2 TVS1.1
U0-TXD: R144.1 U1.141(P0[2]/U0_TXD/U3_TXD)
U1-RX: J5.4 R14.2
U1-TX: J5.5 J5.6 R18.2
U1_RXD: R13.1 U1.106(P2[1]/PWM1[2]/U1_RXD)
U1_TXD: R17.1 U1.107(P2[0]/PWM1[1]/U1_TXD)
U2_RXD: R21.2 U1.70(P0[11]/U2_RXD/I2C2_SCL/T3_MAT1) U4.4(RXD)
U2_TXD: R20.2 U1.69(P0[10]/U2_TXD/I2C2_SDA/T3_MAT0) U4.3(TXD)
U3_RXD: Q3.3(C) R45.2 U1.8(P0[26]/ADC0_IN3/DAC_OUT/U3_RXD)
U3_TXD: D7.2(K) U1.10(P0[25]/ADC0_IN2/I2S_RX_SDA/U3_TXD)
U4_485A: J7.1 J7.3 R19.2 TVS4.2
U4_485B: J7.2 J7.4 R22.2 TVS3.2 TVS4.1
U4_RX: J6.5 R12.2
U4_RXD: R11.1 U1.98(P5[3]/U4_RXD//I2C0_SCL)
U4_TX: J6.6 R16.2
U4_TXD: R15.1 U1.143(P5[4]/U0_OE/T3_MAT3/U4_TXD)
UIM-CLK: J15.12(UIM_CLK) R100.2
UIM-I/O: J15.10(UIM_DATA) R99.2
UIM-RST: J15.14(UIM_RESET) R98.2
UIM-VCC: C66.1 C67.1 J13.1(VCC) J15.8(UIM_PWR) R97.2
USB_LED: LED2.2 U1.32(P0[13]/USB_UP_LED2/SSP1_MOSI/ADC0_IN7)
USBD2+: R87.2 U1.36(P0[31]/USB_D+2)
USBD2-: R86.2 U1.37(USB_D-2)
W5500_/INT: R47.1 U1.96(P2[6]/PWM1_CAP0/U1_RI/T2_CAP0/U2_OE/TRACECELK) U9.36(~{INT})
W5500_/RST: R46.1 U1.94(P4[10]/EMC_A[10]) U9.37(~{RST})
WDI: R28.2 U1.35(P0[27]/I2C0_SDA/USB_SDA1) U6.6(WDI)
XTAL1: C37.1 U1.31(XTAL1) Y2.2
XTAL2: C41.1 U1.33(XTAL2) Y2.1
NetBAT1_1: BAT1.1 D3.3(A)
NetC18_1: C18.1 U3.3(C-)
NetC18_2: C18.2 U3.1(C1+)
NetC19_1: C19.1 U3.2(V+)
NetC23_1: C23.1 U3.5(C2-)
NetC23_2: C23.2 U3.4(C2+)
NetC24_2: C24.2 U3.6(V-)
NetC26_2: C26.2 R26.1 SW1.1(COMMON) SW3.1 U6.1(~{MR})
NetC28_2: C28.2 R29.2 R33.1 U6.7(~{RST})
NetC30_1: C30.1 R36.1 U7.8(RG)
NetC30_2: C30.2 R36.2 TVS5.1
NetC38_1: C38.1 R61.1 U9.30(XI/CLKIN) Y3.1
NetC39_2: C39.2 U9.22(1V2O)
NetC42_1: C42.1 R61.2 U9.31(XO) Y3.2
NetC43_1: C43.1 U9.20(TOCAP)
NetC44_2: C44.2 R67.1 U12.3(TCT)
NetC47_2: C47.2 U12.7(RD+)
NetC51_2: C51.2 U12.8(RD-)
NetC59_1: C59.1 R68.1 R69.1 U12.6(RCT)
NetC61_1: C61.1 L6.1 R43.2 U8.4(Vout)
NetC63_1: C63.1 R137.2 UG2.1
NetC65_1: C65.1 R129.2 UG1.1
NetC68_1: C68.1 J13.3(CLK) R100.1
NetC69_1: C69.1 J13.6(I/O) R97.1 R99.1
NetC70_1: C70.1 J13.2(RST) R98.1
NetC71_1: C71.1 Q7.1(B) R110.1 R114.1
NetC73_2: C73.2 D12.1(A) LED3.2 Q5.2(C) RL1.1(+)
NetC74_1: C74.1 D15.1(A) LED4.2 Q6.2(C) RL2.1(+)
NetC75_1: C75.1 D20.1(A) LED7.2 Q9.2(C) RL3.1(+)
NetC76_2: C76.2 D17.1(A) LED6.2 Q8.2(C) RL4.1(+)
NetC77_1: C77.1 Q5.1(B) R121.2 R125.2
NetC78_2: C78.2 Q6.1(B) R122.2 R126.2
NetC79_2: C79.2 Q9.1(B) R123.2 R127.2
NetC80_1: C80.1 Q8.1(B) R124.2 R128.2
NetC82_1: C82.1 R141.2 UG4.1
NetC84_1: C84.1 R139.2 UG3.1
NetC85_1: C85.1 U16.3(C-)
NetC85_2: C85.2 U16.1(C1+)
NetC86_1: C86.1 U16.2(V+)
NetC87_1: C87.1 U16.5(C2-)
NetC87_2: C87.2 U16.4(C2+)
NetC88_2: C88.2 U16.6(V-)
NetC89_2: C89.2 U5.1(BS)
NetC90_1: C90.1 U5.6(comp)
NetC90_2: C90.2 R27.1
NetD1_2: D1.2 R21.1
NetD2_2: D2.2 R20.1
NetD3_2: D3.2(K) R8.1
NetD4_2: D4.2 R39.1
NetD5_2: D5.2 R37.1
NetD6_1: D6.1(A) Q2.2(C) U11.2(B)
NetD6_2: D6.2(K) R56.1 U11.1(A)
NetD7_1: D7.1(A) R40.1 R44.2
NetF1_2: F1.2 J10.1 U15.4(VCC)
NetJ5_1: J5.1 J5.2 L4.2 L5.1
NetJ10_2: J10.2 R86.1 R88.2 U15.3(I/O2)
NetJ10_3: J10.3 R87.1 R89.2 U15.2(I/O1)
NetJ15_42: J15.42(LED_WWAN) LED5.2
NetLED1_1: LED1.1 R24.1
NetLED1_2: LED1.2 Q1.2(C)
NetLED2_1: LED2.1 R90.1
NetLED3_1: LED3.1 R117.1
NetLED4_1: LED4.1 R118.1
NetLED5_1: LED5.1 R103.2
NetLED6_1: LED6.1 R120.1
NetLED7_1: LED7.1 R119.1
NetQ1_1: Q1.1(B) R34.2 R35.2
NetQ2_1: Q2.1(B) R62.1
NetQ3_1: Q3.1(B) R41.1
NetQ3_2: Q3.2(E) R92.1
NetQ4_1: Q4.1(B) R93.2 R94.2
NetQ4_3: Q4.3(C) R42.1 U8.1(EN)
NetR3_2: R3.2 R4.1
NetR4_2: R4.2 R25.1 U5.5(FB)
NetR5_2: R5.2 U2.1(EN)
NetR6_1: R6.1 R7.2 U2.5(Adj)
NetR8_2: R8.2 U1.27(VBAT)
NetR10_1: R10.1 U4.10(RG)
NetR10_2: R10.2 TVS3.1
NetR11_2: R11.2 U3.12(R1OUT)
NetR12_1: R12.1 U3.13(R1IN)
NetR13_2: R13.2 U3.9(R2OUT)
NetR14_1: R14.1 U3.8(R2IN)
NetR15_2: R15.2 U3.11(T1IN)
NetR16_1: R16.1 U3.14(T1OUT)
NetR17_2: R17.2 U3.10(T2IN)
NetR18_1: R18.1 U3.7(T2OUT)
NetR19_1: R19.1 U4.9(CANL/485A)
NetR22_1: R22.1 U4.8(CANH/485B)
NetR31_2: R31.2 U17.5(A3)
NetR32_2: R32.2 U17.8(A6)
NetR43_1: R43.1 R91.1 U8.5(Adj)
NetR54_1: R54.1 U9.10(EXRES1)
NetR63_2: R63.2 U17.2(A0)
NetR64_2: R64.2 U17.3(A1)
NetR70_2: R70.2 U12.9(GRN+)
NetR71_2: R71.2 U12.12(YEL+)
NetR74_2: R74.2 U13.3(~{WP})
NetR77_2: R77.2 U13.7(~{HOLD})
NetR80_2: R80.2 U14.3(~{WP})
NetR83_2: R83.2 U14.7(NC)
NetR143_2: R143.2 U16.12(R1OUT)
NetR144_2: R144.2 U16.11(T1IN)
NetR145_1: R145.1 U16.13(R1IN)
NetR146_1: R146.1 U16.14(T1OUT)
NetSW1_2: SW1.2(NO) U6.8(~{WDO})

Not connected (* = marked no-connect by the designer): J2 4; J5 3; J6 3 4; J10 5; J13 5(VPP); J15 1(WAKEUP_OUT) 3(NC) 5(NC) 6(NC) 7(NC) 16(UART_DSR) 17(UART_RI) 19(WAKEUP_IN) 20(W_DISABLE_N) 23(UART_CTS) 25(UART_RTS) 30(NC) 31(UART_DTR) 32(NC) 33(UART_DCD) 36(USB_D-) 38(USB_D+) 44(USIM_DET) 45(NC) 46(NC) 47(NC) 48(NC) 49(NC) 51(NC); MAKE1 1; MARKE1 1; MARKE2 1; U1 2(P3[3]/EMC_D[3]) 3(JTAG_TDI) 5(JTAG_TRST) 9(P3[4]/EMC_D[4]) 11(P0[24]/ADC0_IN1/I2S_RX_WS/T3_CAP1) 12(P3[5]/EMC_D[5]) 13(P0[23]/AD0_IN0/I2S_RX_SCK/T3_CAP0) 16(P3[6]/EMC_D[6]) 19(P3[7]/EMC_D[7]) 20(RSTOUT) 21(P5[1]/EMC_BLS3/U3_RXD/T2_MAT1/I2C2_SCL) 26(RTC_ALARM) 28(P1[31]/USB_OVRCR2/SSP1_SCK/ADC0_IN5/I2C0_SCL) 30(P1[30]/USB_PWRD2/USB_VBUS/ADC0_IN4/I2C0_SDA/U3_OE) 34(P0[28]/I2C0_SCL/USB_SCL1) 40(P3[24]/EMC_D[24]/PWM1[1]/T0_CAP1) 42(P0[29]/USB_D+1/EINT0) 43(P0[30]/USB_D-1/EINT1) 45(P3[23]/EMC_D[23]/PWM1_CAP0/T0_CAP0) 48(P0[14]/USB_HSTEN2/SSP1_SSEL/USB_CONNECT2) 50(P1[21]/USB_TX_DM1/PWM1[3]/SSP0_SSEL/MC_ABORT) 52(P4[0]/EMC_A[0]) 55(P4[1]/EMC_A[1]) 56(P1[25]/USB_LS1/USB_HSTEN1/T1_MAT1/MC_1A/CLKOUT) 58(P4[2]/EMC_A[2]) 61(P1[27]/USB_INT1/USB_OVRCR1/T0_CAP1/CLKOUT) 71(P2[13]/EINT3/SD_DAT[3]/I2S_TX_SDA) 74(P4[5]/EMC_A[5]) 75(P2[11]/EINT1/SD_DAT[1]/I2S_TX_SCK) 78(P4[6]/EMC_A[6]) 81(P5[2]/T3_MAT2/I2C0/SDA) 83(P0[20]/U1_DTR/SD_CMD/I2C1_SCL) 84(P4[7]/EMC_A[7]) 85(P0[19]/U1_DSR/SD_CLK/I2C1_SDA) 88(P4[8]/EMC_A[8]) 91(P4[9]/EMC_A[9]) 92(P2[9]/USB_CONNECT1/U2_RXD/U4_RXD/ENET_MDIO) 97(P2[5]/PWM1[6]/U1_DTR/T2_MAT0/TRACEDATA[0]) 99(P2[4]/PWM1[5]/U1_DSR/T2_MAT1/TRACEDATA[1]) 100(P2[3]/PWM1[4]/U1_DCD/T2_MAT2/TRACEDATA[2]) 101(P4[11]/EMC_A[11]) 104(P4[12]/EMC_A[12]) 105(P2[2]/PWM1[3]/U1_CTS/T2_MAT3/TRACEDATA[3]) 108(P4[13]/EMC_A[13]) 109(P0[9]/I2S_TX_SDA/SSP1_MOSI/T2_MAT3/RTC_EV2) 110(P4[14]/EMC_A[14]) 111(P0[8]/I2S_TX_WS/SSP1_MISO/T2_MAT2/RTC_EV1) 112(P0[7]/I2S_TX_SCK/SSP1_SCK/T2_MAT1/RTC_EV0) 113(P0[6]/I2S_RX_SDA/SSP1_SSEL/T2_MAT0/U1_RTS) 115(P0[5]/I2S_RX_WS/TD2/T2CAP1) 116(P0[4]/I2C_RX_SCK/RD2/T2_CAP0) 123(P1[17]/ENET_MDIO/I2S_RX_MCLK) 125(P1[16]/ENET_MDC/I2S_TX_MCLK) 126(P1[15]/ENET_RX_CLK/I2C2_SDA) 127(P4[24]/EMC_OE) 128(P1[14]/ENET_RX_ER/T2_CAP0) 129(P1[10]/ENET_RXD1/T3_CAP0) 130(P4[30]/EMC_CS0) 131(P1[9]/ENET_RXD0/T3_MAT0) 134(P4[31]/EMC_CS1) 137(P3[0]/EMC_D[0]) 140(P3[1]/EMC_D[1]) 144(P3[2]/EMC_D[2]); U5 8(SS); U6 5(~{PFO})*; U9 7(DNC) 18(VBG); U12 4(NC) 5(NC); U16 7(T2OUT) 8(R2IN) 9(R2OUT) 10(T2IN); U17 4(A2) 6(A4) 7(A5) 9(A7) 11(B7) 13(B5) 14(B4) 16(B2)

## Notes on the sheet
- 电压转换电路
- RS485   CAN   电路
- ISP电路
- 运行指示灯
- (near U6) 看门狗复位电路
- 晶振电路
- 铁电数据存储
- NORFLASH数据存储
- 以太网电路
- 开关量反馈电路
- 1，F1为可恢复保险管SMD0.5A/0805
- 1，LEDCS信号为兼容跑马灯
- USB电路
- 蜂鸣器
- 灯板电路
- (near J13) SIM卡
- 彩屏,，读卡器，串口接口电路
- 4G模块电路
- 继电器电路
- (in symbol CAPACITOR POL) +

## Library data of the parts
C1-C16 C36 C37 C40 C41 = CAP1
C17-C21 C23 C24 C32 C38 C39 C42 C44 C47-C51 C53-C59 C62-C65 C73 C76 C77 C80-C88 = CAP: Capacitor
C22 C26-C29 = CAP1: CAP
C25 = CAP_1
C30 C72 = 0.1uF: C0603; Published: *; LatestRevisionDate: *; LatestRevisionNote: *; Publisher: *; Value: *
C31 EC1 EC4 = CAP2
C33 C52 C60 C61 C66-C71 C89 C90 = CAP
C43 C45 C46 EC2 EC3 = CAPACITOR POL: Capacitor
C74 C75 C78 C79 = Cap: Capacitor; Published: *; LatestRevisionDate: *; LatestRevisionNote: *; PackageReference: *; Publisher: *; Value: *
D6-D9 D12 D15 D17 D20 = DIODE
EC5 EC6 = ELECTRO2
F1 = FUSE1: Fuse
J1 J2 J9 = 4 HEADER: 4 Pin Header
J4 J6 = CON6: Connector
J10 = CON5: Connector
J13 = UIM6
L3 L6-L9 = INDUCTOR
L4 L5 R10-R23 R31 R32 R46-R53 R55-R57 R59 R60 R62-R64 R101 R102 R143-R146 = RES-1: RES
LED1-LED7 = LED
MAKE1 MARKE1-MARKE3 T1 = CON1: Connector
Q1-Q9 = NPN
R1 R2 R5-R8 R24 R26 R28-R30 R33-R35 R54 R58 R61 R65-R71 R74-R85 R117-R130 R137-R142 = RES1
R3 R4 R25 R27 = R_S
R36 R116 = RES2: 物料: 1.01.03.0019; 规: 1MΩ,1206,RoHS; 贴片: SMT; 现有: 16230; RoHS: RoHS; ComponentLink1Description: ErpDataInfo; ComponentLink1URL: http://192.168.0.2:8012/ErpExt/ErpData/ListMateriel.aspx?pkey=1.01.03.0019
R37-R39 R86-R90 = RES2
  R38: 物料: *; Value: 120R; 规: *; RoHS: *; 贴片: *; ComponentLink1Description: *; ComponentLink1URL: *; 现有: *
R40-R45 R91-R94 R97-R100 R103 R110 R114 R115 = RES
RL1-RL4 = JQ1P-12V
SW3 = SW-PB
TVS1 TVS4 TVS6 = TVS
TVS2 TVS3 TVS5 = TVS-D
U1 = LPC1778LQFP144
U3 U16 = MAX232ESE
U10 = NUP4301: NUP4301MR6T1
U12 = LU1T516
U14 = MX25L1635EM2I-10G
U15 = PRTR5V0U2X_1
UG1-UG4 = PS2501-1
Y1-Y3 = CRYSTAL